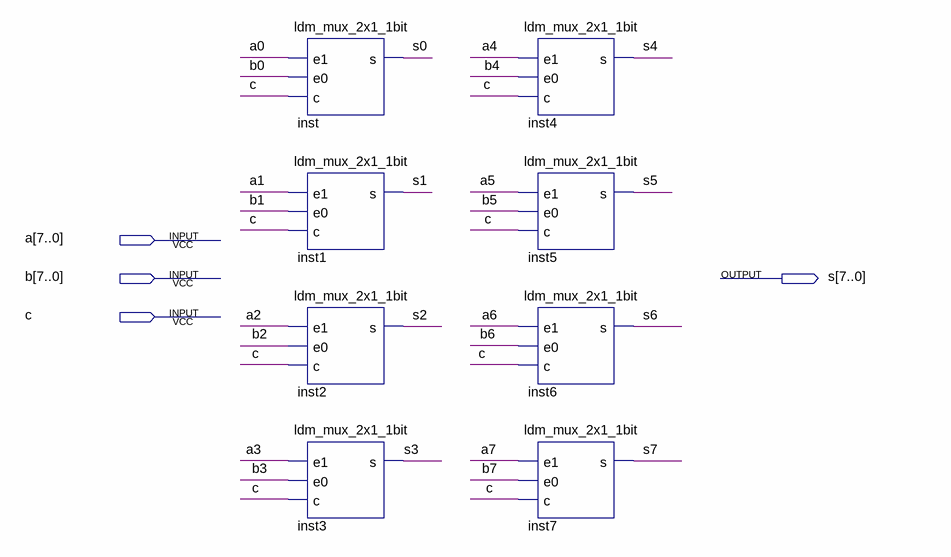
[diagram p0: schematic sheet]
// Quartus schematic ldm_mux_2x1_8bits.bdf as structural Verilog: 8 symbols, 4 pins
module ldm_mux_2x1_8bits (
  input  [7:0] a,
  input  [7:0] b,
  input  c,
  output [7:0] s
);

  ldm_mux_2x1_1bit inst (.e1(a[0]), .e0(b[0]), .c(c), .s(s[0]));
  ldm_mux_2x1_1bit inst1 (.e1(a[1]), .e0(b[1]), .c(c), .s(s[1]));
  ldm_mux_2x1_1bit inst2 (.e1(a[2]), .e0(b[2]), .c(c), .s(s[2]));
  ldm_mux_2x1_1bit inst3 (.e1(a[3]), .e0(b[3]), .c(c), .s(s[3]));
  ldm_mux_2x1_1bit inst4 (.e1(a[4]), .e0(b[4]), .c(c), .s(s[4]));
  ldm_mux_2x1_1bit inst5 (.e1(a[5]), .e0(b[5]), .c(c), .s(s[5]));
  ldm_mux_2x1_1bit inst6 (.e1(a[6]), .e0(b[6]), .c(c), .s(s[6]));
  ldm_mux_2x1_1bit inst7 (.e1(a[7]), .e0(b[7]), .c(c), .s(s[7]));
endmodule
